# EAGLE schematic ft2_redraw (EAGLE 8.5.1)
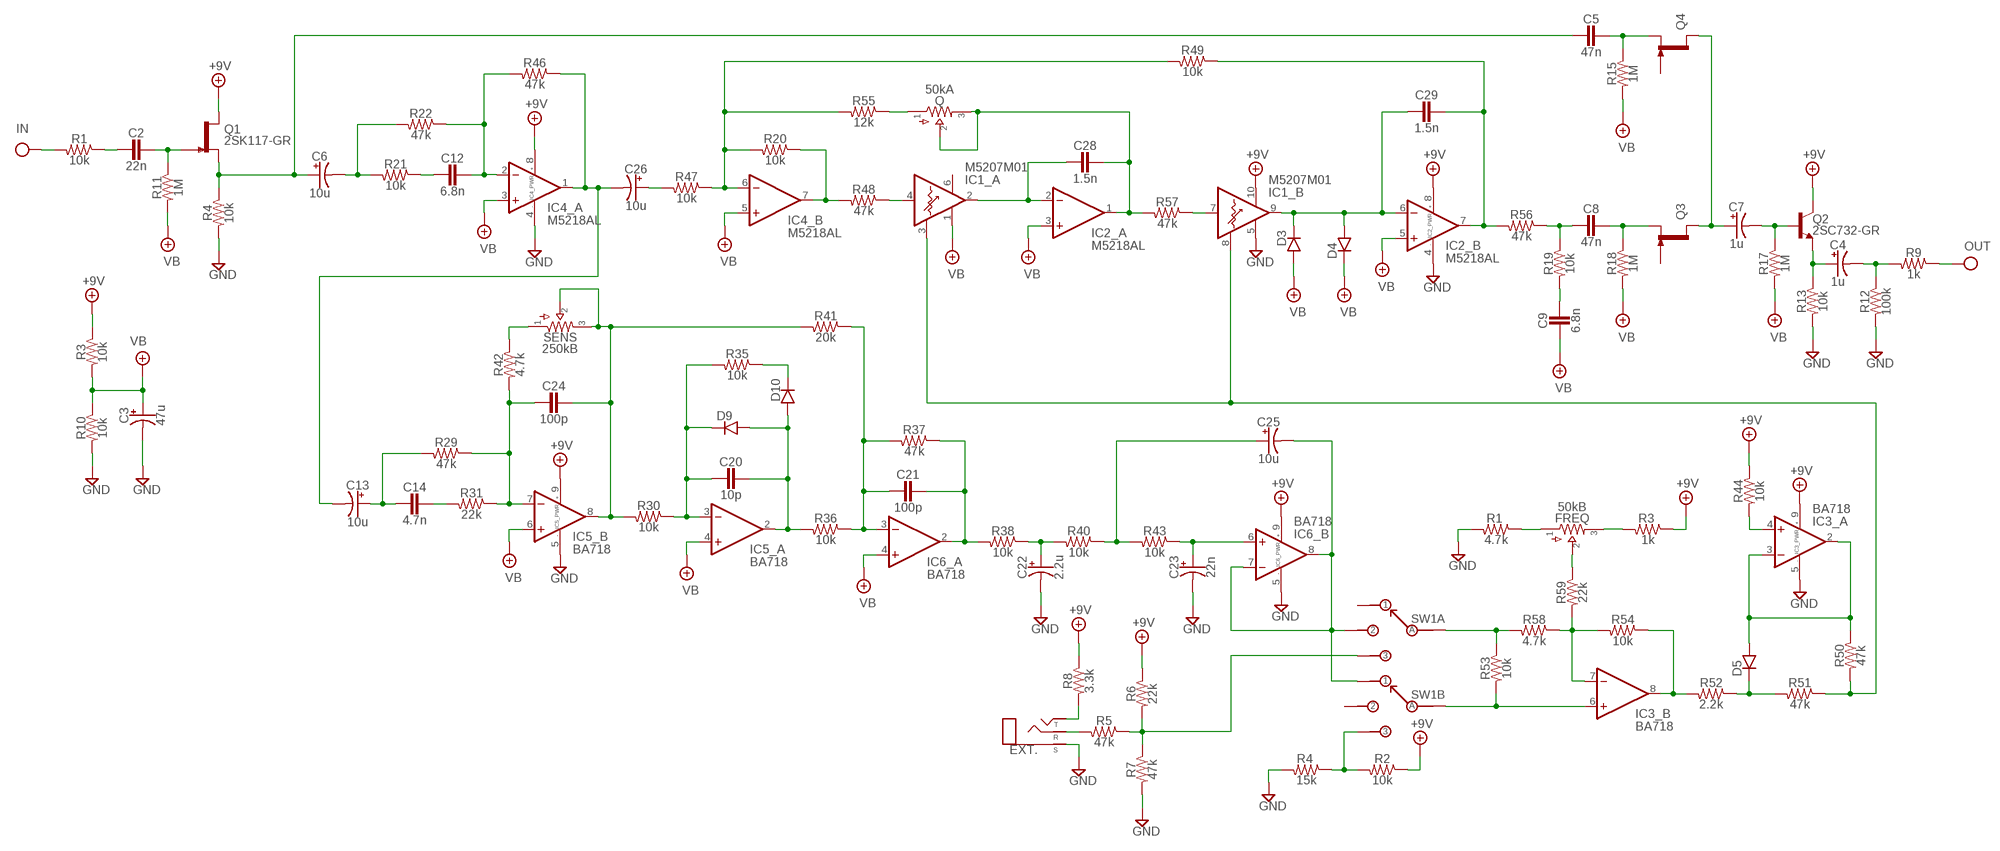
[diagram p0: schematic, sheet 1]

## Parts
C2  22n  CER/FILMBOX.1  [BOX_SMALL]
C3  47u  0400  [040_020]
C4  1u  0400  [040_020]
C5  47n  CER/FILMBOX.1  [BOX_SMALL]
C6  10u  0400  [040_020]
C7  1u  0400  [040_020]
C8  47n  CER/FILMBOX.1  [BOX_SMALL]
C9  6.8n  CER/FILMBOX.1  [BOX_SMALL]
C12  6.8n  CER/FILMBOX.1  [BOX_SMALL]
C13  10u  0400  [040_020]
C14  4.7n  CER/FILMBOX.1  [BOX_SMALL]
C20  10p  CER/FILMBOX.1  [BOX_SMALL]
C21  100p  CER/FILMBOX.1  [BOX_SMALL]
C22  2.2u  0400  [040_020]
C23  22n  0400  [040_020]
C24  100p  CER/FILMBOX.1  [BOX_SMALL]
C25  10u  0400  [040_020]
C26  10u  0400  [040_020]
C28  1.5n  CER/FILMBOX.1  [BOX_SMALL]
C29  1.5n  CER/FILMBOX.1  [BOX_SMALL]
D3  DO35.2  [DO35-2]
D4  DO35.2  [DO35-2]
D5  DO35.2  [DO35-2]
D9  DO35.2  [DO35-2]
D10  DO35.2  [DO35-2]
EXT.  STEREO  [STEREO_PCB]
FREQ  50kB  POTS16MM  [16MM]
IC1  M5207M01  M5207L01  [SIL10]
IC2  M5218AL  DUALTH  [DIL0]
IC3  BA718  DUAL  [SIL09]
IC4  M5218AL  DUALTH  [DIL0]
IC5  BA718  DUAL  [SIL09]
IC6  BA718  DUAL  [SIL09]
Q  50kA  POTS16MM  [16MM]
Q1  2SK117-GR  2N5457  [TO92-]
Q2  2SC732-GR  2N3904  [TO92-]
Q3  2N3819TO-92S  [TO92-]
Q4  2N3819TO-92S  [TO92-]
R1  10k  R_.3B  [R0207/3]
R1   4.7k  R_.3B  [R0207/3]
R2  10k  R_.3B  [R0207/3]
R3  10k  R_.3B  [R0207/3]
R3   1k  R_.3B  [R0207/3]
R4  10k  R_.3B  [R0207/3]
R4   15k  R_.3B  [R0207/3]
R5  47k  R_.3B  [R0207/3]
R6  22k  R_.3B  [R0207/3]
R7  47k  R_.3B  [R0207/3]
R8  3.3k  R_.3B  [R0207/3]
R9  1k  R_.3B  [R0207/3]
R10  10k  R_.3B  [R0207/3]
R11  1M  R_.3B  [R0207/3]
R12  100k  R_.3B  [R0207/3]
R13  10k  R_.3B  [R0207/3]
R15  1M  R_.3B  [R0207/3]
R17  1M  R_.3B  [R0207/3]
R18  1M  R_.3B  [R0207/3]
R19  10k  R_.3B  [R0207/3]
R20  10k  R_.3B  [R0207/3]
R21  10k  R_.3B  [R0207/3]
R22  47k  R_.3B  [R0207/3]
R29  47k  R_.3B  [R0207/3]
R30  10k  R_.3B  [R0207/3]
R31  22k  R_.3B  [R0207/3]
R35  10k  R_.3B  [R0207/3]
R36  10k  R_.3B  [R0207/3]
R37  47k  R_.3B  [R0207/3]
R38  10k  R_.3B  [R0207/3]
R40  10k  R_.3B  [R0207/3]
R41  20k  R_.3B  [R0207/3]
R42  4.7k  R_.3B  [R0207/3]
R43  10k  R_.3B  [R0207/3]
R44  10k  R_.3B  [R0207/3]
R46  47k  R_.3B  [R0207/3]
R47  10k  R_.3B  [R0207/3]
R48  47k  R_.3B  [R0207/3]
R49  10k  R_.3B  [R0207/3]
R50  47k  R_.3B  [R0207/3]
R51  47k  R_.3B  [R0207/3]
R52  2.2k  R_.3B  [R0207/3]
R53  10k  R_.3B  [R0207/3]
R54  10k  R_.3B  [R0207/3]
R55  12k  R_.3B  [R0207/3]
R56  47k  R_.3B  [R0207/3]
R57  47k  R_.3B  [R0207/3]
R58  4.7k  R_.3B  [R0207/3]
R59  22k  R_.3B  [R0207/3]
SENS  250kB  POTS16MM  [16MM]
SW1A  1P3T  [1P3T]
SW1B  1P3T  [1P3T]

## Nets
+9V: IC1.10(_B:+PWR) IC2.8(_PWR:V+) IC3.9(_PWR:V+) IC4.8(_PWR:V+) IC5.9(_PWR:V+) IC6.9(_PWR:V+) Q1.3(D) Q2.1(C) R2.1 R3.1 R3 .1 R6.1 R8.1 R44.1
GND: C3.- C22.- C23.- EXT..P$1(S) IC1.5(_B:-PWR) IC2.4(_PWR:V-) IC3.5(_PWR:V-) IC4.4(_PWR:V-) IC5.5(_PWR:V-) IC6.5(_PWR:V-) R1 .2 R4.2 R4 .2 R7.2 R10.2 R12.2 R13.2
IN: R1.2
N$1: C6.- R21.2 R22.2
N$2: C12.1 IC4.2(_A:-IN) R22.1 R46.2
N$3: C2.2 R1.1
N$4: C2.1 Q1.1(G) R11.1
N$5: C13.- C26.- IC4.1(_A:OUT) R46.1
N$6: C12.2 R21.1
N$7: C26.+ R47.2
N$8: IC4.6(_B:-IN) R20.2 R47.1 R49.2 R55.2
N$9: IC4.7(_B:OUT) R20.1 R48.2
N$10: IC1.7(_B:IN) R57.1
N$11: C28.1 IC2.1(_A:OUT) Q.2 Q.3 R57.2
N$12: Q.1 R55.1
N$13: IC1.4(_A:IN) R48.1
N$14: C28.2 IC1.2(_A:OUT) IC2.2(_A:-IN)
N$15: C29.2 D3.C D4.A IC1.9(_B:OUT) IC2.6(_B:-IN)
N$16: IC1.3(_A:VC) IC1.8(_B:VC) R50.2 R51.1
N$17: C29.1 IC2.7(_B:OUT) R49.1 R56.2
N$18: C8.2 R19.1 R56.1
N$19: C8.1 Q3.1(S) R18.1
N$20: C9.1 R19.2
N$21: C7.+ Q3.3(D) Q4.3(D)
N$22: C7.- Q2.2(B) R17.1
N$23: C4.+ Q2.3(E) R13.1
N$24: C4.- R9.2 R12.1
N$25: C5.1 Q4.1(S) R15.1
N$26: C13.+ C14.2 R29.2
N$27: C14.1 R31.2
N$28: C24.2 IC5.7(_B:-IN) R29.1 R31.1 R42.2
N$29: C20.2 D9.C IC5.3(_A:-IN) R30.1 R35.2
N$30: C24.1 IC5.8(_B:OUT) R30.2 R41.2 SENS.2 SENS.3
N$31: C20.1 D9.A D10.A IC5.2(_A:OUT) R36.2
N$32: R42.1 SENS.1
N$33: C21.2 IC6.3(_A:-IN) R36.1 R37.2 R41.1
N$34: D10.C R35.1
N$35: C22.+ R38.1 R40.2
N$36: C21.1 IC6.2(_A:OUT) R37.1 R38.2
N$37: C25.+ R40.1 R43.2
N$38: C23.+ IC6.6(_B:+IN) R43.1
N$39: C25.- IC6.7(_B:-IN) IC6.8(_B:OUT) SW1A.P$3 SW1B.P$2
N$40: EXT..P$3(T) R8.2
N$41: EXT..P$2(R) R5.2
N$42: R2.2 R4 .1 SW1B.P$4
N$43: R5.1 R6.2 R7.1 SW1A.P$4
N$44: R53.1 R58.2 SW1A.P$1(A)
N$45: IC3.6(_B:+IN) R53.2 SW1B.P$1(A)
N$46: IC3.7(_B:-IN) R54.2 R58.1 R59.2
N$47: IC3.8(_B:OUT) R52.2 R54.1
N$48: D5.C R51.2 R52.1
N$49: D5.A IC3.2(_A:OUT) IC3.3(_A:-IN) R50.1
N$51: FREQ.1 R1 .1
N$52: FREQ.2 R59.1
N$53: FREQ.3 R3 .2
N$55: IC3.4(_A:+IN) R44.2
N$121: C5.2 C6.+ Q1.2(S) R4.1
OUT: R9.1
VB: C3.+ C9.2 D3.A D4.C IC1.1(_A:-PWR) IC2.3(_A:+IN) IC2.5(_B:+IN) IC4.3(_A:+IN) IC4.5(_B:+IN) IC5.4(_A:+IN) IC5.6(_B:+IN) IC6.4(_A:+IN) R3.2 R10.1 R11.2 R15.2 R17.2 R18.2
Unconnected: Q3.2(G) Q4.2(G) SW1A.P$2 SW1B.P$3

## Power pins joined to a net without a drawn wire
+PWR: IC1.6(_A:+PWR)

## Library data of the parts
C2 C5 C8 C9 C12 C14 C20 C21 C24 C28 C29 = pedals-capacitors-film:CER/FILM: 47 - 120pF Xicon Ceramic Disc 2.5mm lead spacing
C3 C4 C6 C7 C13 C22 C23 C25 C26 = pedals-capacitors-elec:040
D3-D5 D9 D10 = pedals-diodes:DO35: DO-35 Package Diodes: 1N914
EXT. = pedals-jacks:STEREO
FREQ Q SENS = pedals-potentiometers:POTS
IC1 = pedals-integrated circuits:M5207L01
IC2-IC6 = pedals-integrated circuits:DUAL: OP AMP
Q1 = pedals-transistors:2N5457: N-CHANNEL JFET
Q2 = pedals-transistors:2N3904: NPN Transistor
Q3 Q4 = pedals-transistors:2N3819: N-CHANNEL FET
R1 R1  R2 R3 R3  R4 R4  R5-R13 R15 R17-R22 R29-R31 R35-R38 R40-R44 R46-R59 = pedals-resistors:R_
SW1A SW1B = pedals-switches:1P3T